# Altium project Team_Scheire_Maarten_00.PrjPcb
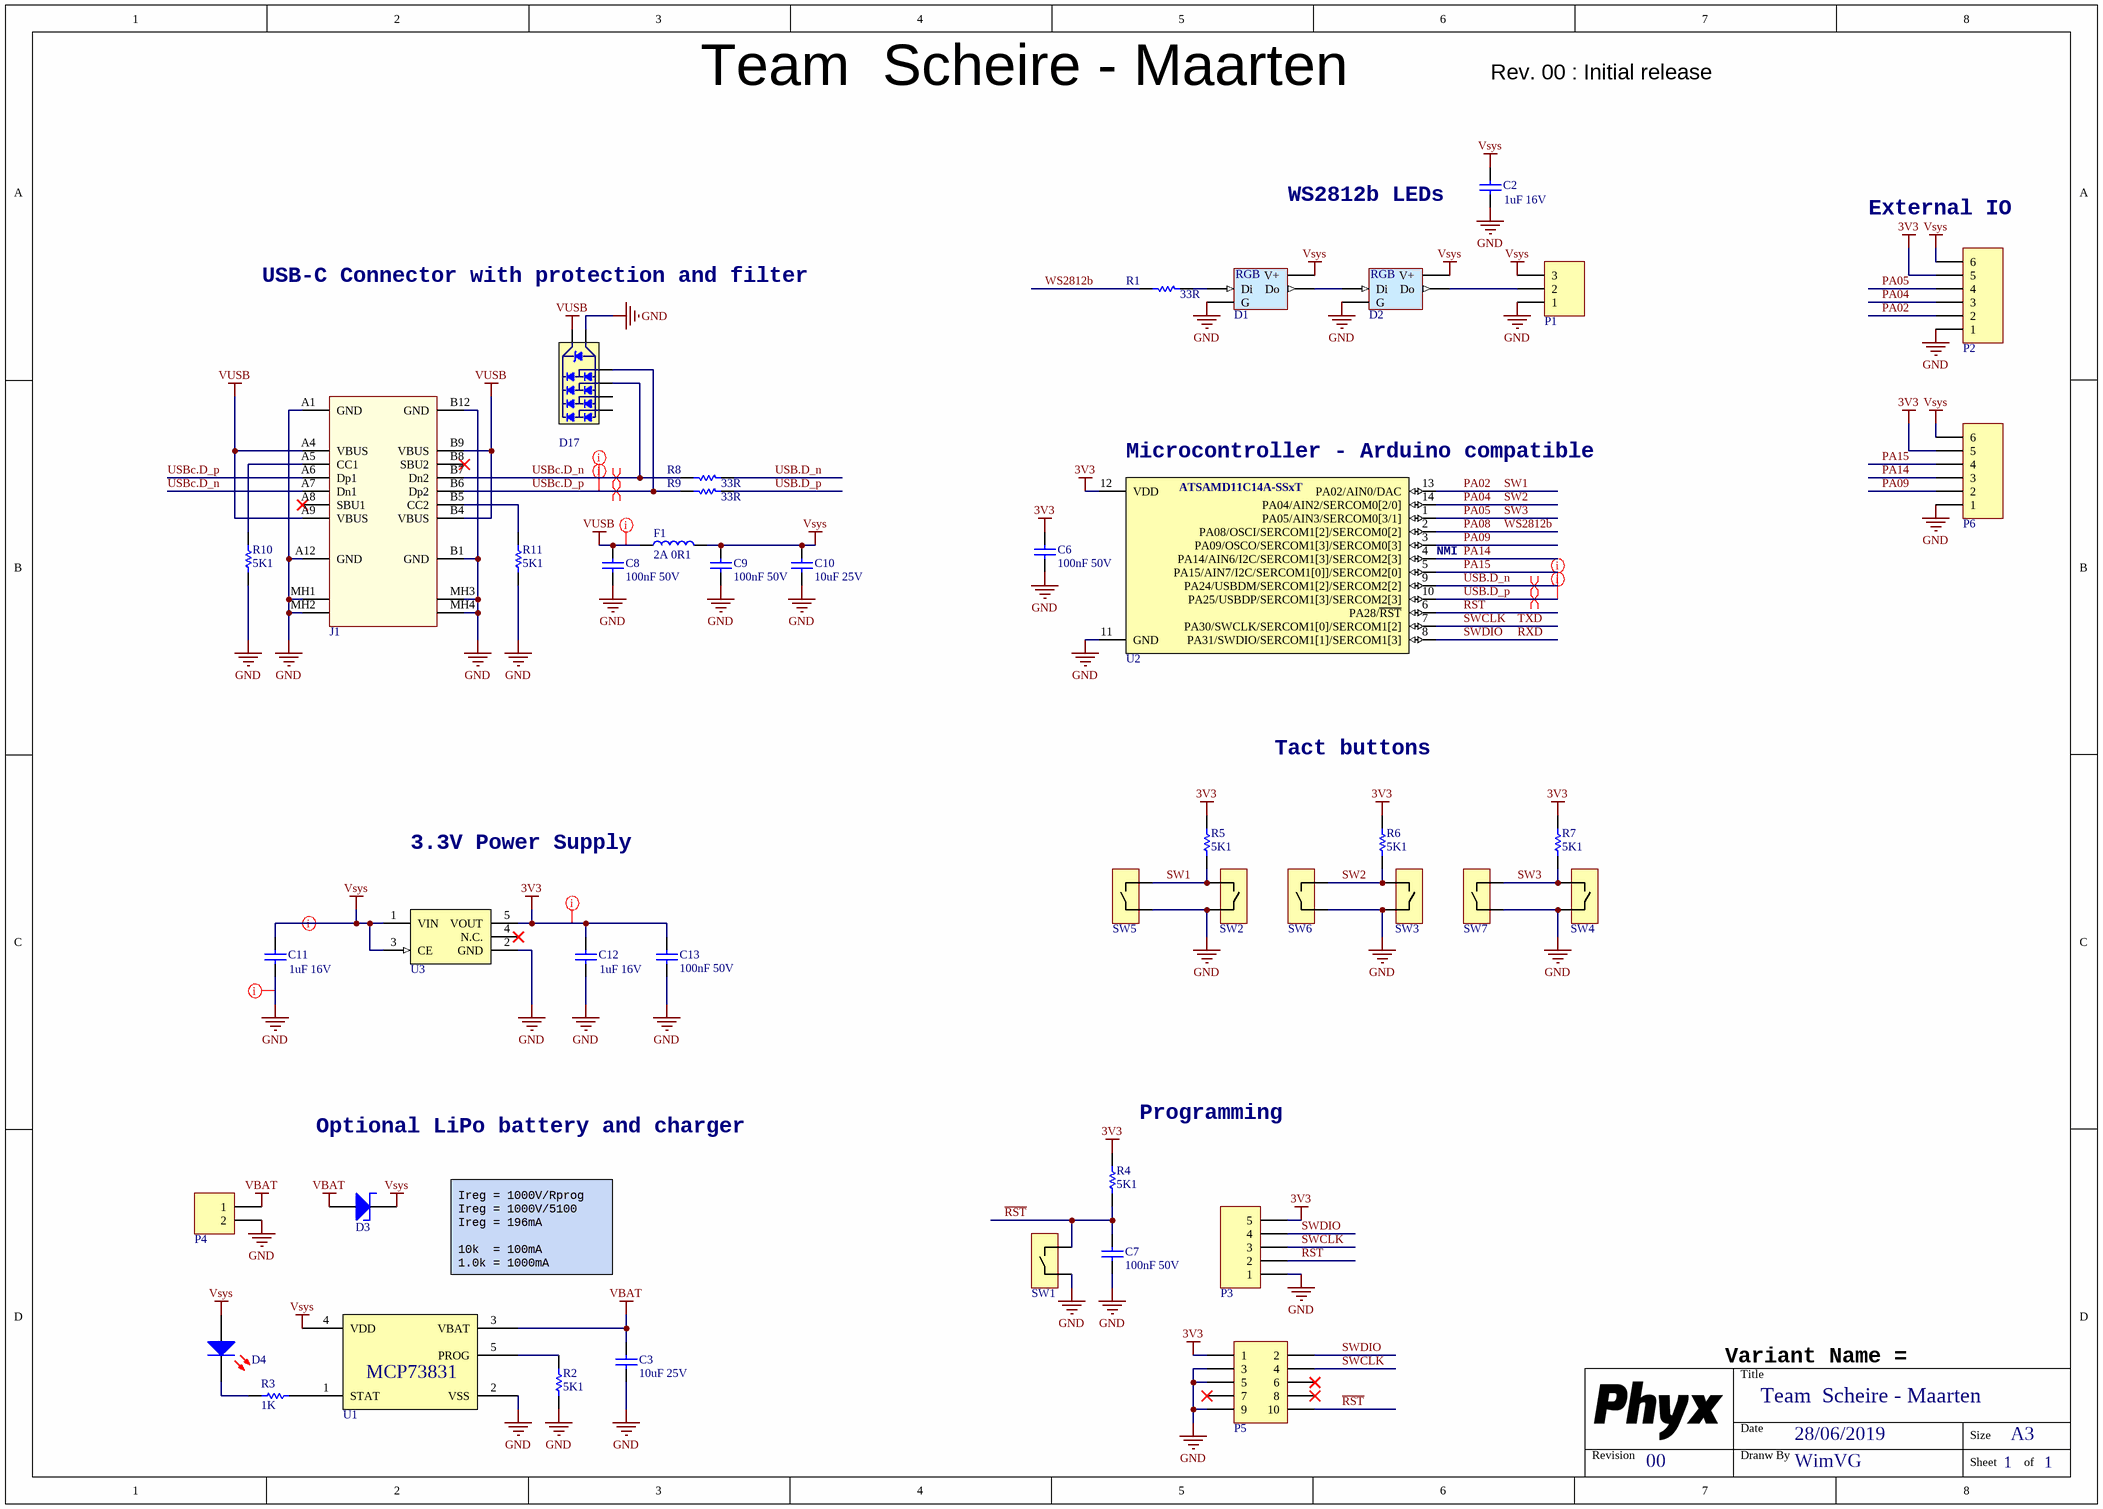
[diagram p0: Team_Scheire_Maarten_00.SchDoc]
PCB_ENGINEER: WimVG; PCB_REV: 00; PCB_TITLE: Team_Scheire_Maarten
1 sheet, 44 parts. Net scope: global (net labels, ports and power ports of the same name join across sheets).
Board file: Team_Scheire_Maarten_00.PcbDoc

## Sheet Team_Scheire_Maarten_00.SchDoc: Team  Scheire - Maarten
size A3; Date: 28/06/2019; DrawnBy: WimVG; Engineer: WimVG; Revision: 00; SheetNumber: 1; SheetTotal: 1

### Parts
C2  value 1uF 16V  [C0603_N]  (hidden comment: CAP_CERAMIC)
C3  value 10uF 25V  [C1206_N]  (hidden comment: CAP_CERAMIC)
C6  value 100nF 50V  [C0603_N]  (hidden comment: CAP_CERAMIC)
C7  value 100nF 50V  [C0603_N]  (hidden comment: CAP_CERAMIC)
C8  value 100nF 50V  [C0603_N]  (hidden comment: CAP_CERAMIC)
C9  value 100nF 50V  [C0603_N]  (hidden comment: CAP_CERAMIC)
C10  value 10uF 25V  [C1206_N]  (hidden comment: CAP_CERAMIC)
C11  value 1uF 16V  [C0603_N]  (hidden comment: CAP_CERAMIC)
C12  value 1uF 16V  [C0603_N]  (hidden comment: CAP_CERAMIC)
C13  value 100nF 50V  [C0603_N]  (hidden comment: CAP_CERAMIC)
D1  WS2812 based digital RGB LED 5050 Black package  [LED_5050_WS2812B_BLACK]  (value not drawn)
D2  WS2812 based digital RGB LED 5050 Black package  [LED_5050_WS2812B_BLACK]  (value not drawn)
D3  MBR0540T3G Schottky ULTRAFAST, 500MA, 40V  [ON_SOD-123FL]  (value not drawn)
D4  Default 0805 Red LED  [LED_0805_RD]  (value not drawn)
D17  TVS Diode Dual USB  [NXP_SOT457]  (value not drawn)
F1  value 2A 0R1  [L0805]  (hidden comment: FERRITE)
J1  USB 2.0 C Reversible Receptacle Horizontal  [HRO_TYPE-C-31-M-12]  (value not drawn)
P1  Header 2.0mm Shrouded 3  [WE_620103131822]  (value not drawn)
P2  Header 6  [HDR1X6]  (value not drawn)
P3  Header 1.0mm Shrouded 5  [WE_665305124022]  (value not drawn)
P4  Header 2.0mm Shrouded 2  [WE_620102131822]  (value not drawn)
P5  Header 5x2  [HDR2X5_1.27_SMD]  (value not drawn)
P6  Header 6  [HDR1X6]  (value not drawn)
R1  value 33R  [R0603_N]  (hidden comment: RESISTOR)
R2  value 5K1  [R0603_N]  (hidden comment: RESISTOR)
R3  value 1K  [R0603_N]  (hidden comment: RESISTOR)
R4  value 5K1  [R0603_N]  (hidden comment: RESISTOR)
R5  value 5K1  [R0603_N]  (hidden comment: RESISTOR)
R6  value 5K1  [R0603_N]  (hidden comment: RESISTOR)
R7  value 5K1  [R0603_N]  (hidden comment: RESISTOR)
R8  value 33R  [R0603_N]  (hidden comment: RESISTOR)
R9  value 33R  [R0603_N]  (hidden comment: RESISTOR)
R10  value 5K1  [R0603_N]  (hidden comment: RESISTOR)
R11  value 5K1  [R0603_N]  (hidden comment: RESISTOR)
SW1  LP SMD tact sw  [CK_KMR4]  (value not drawn)
SW2  Tact switch, 12mm, 160g, 7,3mm rect  [ESW_TL3300A]  (value not drawn)
SW3  Tact switch, 12mm, 160g, 7,3mm rect  [ESW_TL3300A]  (value not drawn)
SW4  Tact switch, 12mm, 160g, 7,3mm rect  [ESW_TL3300A]  (value not drawn)
SW5  4.5x4.5mm tact SMD H3,8mm  [WE_430181038816]  (value not drawn)
SW6  4.5x4.5mm tact SMD H3,8mm  [WE_430181038816]  (value not drawn)
SW7  4.5x4.5mm tact SMD H3,8mm  [WE_430181038816]  (value not drawn)
U1  Single Cell LiPo LiIon charger  [SOT23-5]  (value not drawn)
U2  Microchip Atmel SAMD11C14 SOIC14 Cortex-M0 32-bit MCU, 16 KB Flash, 4KB RAM  [SOIC_N_14]  (value not drawn)
U3  3V3 LDO 700mA 50mV  [SOT23-5]  (value not drawn)

### Nets
3V3: C6.1 C12.1 C13.1 P2.5 P3.5 P5.1 P6.5 R4.1 R5.1 R6.1 R7.1 U2.12(VDD) U3.5(VOUT)
GND: C2.2 C3.2 C6.2 C7.2 C8.2 C9.2 C10.2 C11.2 C12.2 C13.2 D1.3(G) D2.3(G) D17.2(GND) J1.A1(GND) J1.A12(GND) J1.B1(GND) J1.B12(GND) J1.MH1(Tab) J1.MH2(Tab) J1.MH3(Tab) J1.MH4(Tab) P1.1 P2.1 P3.1 P4.2 P5.3 P5.5 P5.9 P6.1 R2.2 R10.2 R11.2 SW1.2 SW2.2 SW3.2 SW4.2 SW5.2 SW6.2 SW7.2 U1.2(VSS) U2.11(GND) U3.2(GND)
VBAT: C3.1 D3.2(A) P4.1 U1.3(VBAT)
Vsys: C2.1 C9.1 C10.1 C11.1 D1.1(V+) D2.1(V+) D3.1(C) D4.1(A) F1.2 P1.3 P2.6 P6.6 U1.4(VDD) U3.1(VIN) U3.3(CE)
VUSB: C8.1 D17.5(VBus) F1.1 J1.A4(VBUS) J1.A9(VBUS) J1.B4(VBUS) J1.B9(VBUS)
PA02: P2.2 R5.2 SW2.1 SW5.1 U2.13(PA02/AIN0/DAC)  [also labelled SW1]
PA04: P2.3 R6.2 SW3.1 SW6.1 U2.14(PA04/AIN2/SERCOM0[2/0])  [also labelled SW2]
PA05: P2.4 R7.2 SW4.1 SW7.1 U2.1(PA05/AIN3/SERCOM0[3/1])  [also labelled SW3]
PA08: R1.1 U2.2(PA08/OSCI/SERCOM1[2]/SERCOM0[2])  [also labelled WS2812b]
PA09: P6.2 U2.3(PA09/OSCO/SERCOM1[3]/SERCOM0[3])
PA14: P6.3 U2.4(PA14/AIN6/I2C/SERCOM1[3]/SERCOM2[3])
PA15: P6.4 U2.5(PA15/AIN7/I2C/SERCOM1[0]]/SERCOM2[0])
~{RST}: C7.1 P3.2 P5.10 R4.2 SW1.1 U2.6(PA28/~{RST})
RXD: P3.4 P5.2 U2.8(PA31/SWDIO/SERCOM1[1]/SERCOM1[3])  [also labelled SWDIO]
SWCLK: P3.3 P5.4 U2.7(PA30/SWCLK/SERCOM1[0]/SERCOM1[2])  [also labelled TXD]
USB.D_n: R8.2 U2.9(PA24/USBDM/SERCOM1[2]/SERCOM2[2])
USB.D_p: R9.2 U2.10(PA25/USBDP/SERCOM1[3]/SERCOM2[3])
USBc.D_n: D17.1 J1.A7(Dn1) J1.B7(Dn2) R8.1
USBc.D_p: D17.3 J1.A6(Dp1) J1.B6(Dp2) R9.1
NetD1_2: D1.2(Do) D2.4(Di)
NetD1_4: D1.4(Di) R1.2
NetD2_2: D2.2(Do) P1.2
NetD4_2: D4.2(K) R3.2
NetJ1_A5: J1.A5(CC1) R10.1
NetJ1_B5: J1.B5(CC2) R11.1
NetR2_1: R2.1 U1.5(PROG)
NetR3_1: R3.1 U1.1(STAT)

Not connected (* = marked no-connect by the designer): D17 4 6; J1 A8(SBU1)* B8(SBU2)*; P5 6* 7* 8*; U3 4(N.C.)*

### Layout directives
differential pair: USB.D_n, USB.D_p, USBc.D_n, USBc.D_p
net class 90R: USB.D_n, USB.D_p, USBc.D_n, USBc.D_p
net class Power: 3V3, GND, Vsys, VUSB

### Notes on the sheet
- Rev. 00 : Initial release
- WS2812b LEDs
- (near P2) External IO
- USB-C Connector with protection and filter
- (near U2) Microcontroller - Arduino compatible
- (near U2) NMI
- Tact buttons
- 3.3V Power Supply
- (near R4) Programming
- Optional LiPo battery and charger
- Ireg = 1000V/Rprog
  Ireg = 1000V/5100
  Ireg = 196mA
  10k  = 100mA
  1.0k = 1000mA
- Variant Name =
- Title
- Revision
- Date
- Dranw By
- Size
- A3
- Sheet
- of
- (in symbol LED # RGB WS2812B-5050 BL) RGB

### Library data of the parts
C2 C11 C12 = CAP # 1uF 16V 0603: Capacitor Ceramic; Supplier 1: Farnell; Supplier Part Number 1: 2320814
C3 C10 = CAP # 10uF 25V 1206: Supplier 1: Farnell; Supplier Part Number 1: 2320887
C6-C9 C13 = CAP # 100nF 50V 0603: Supplier 1: Farnell; Supplier Part Number 1: 1759122
D1 D2 = LED # RGB WS2812B-5050 BL: =Description; Value: WS218B 5050 BL; Supplier 1: Aliexpress; Supplier Part Number 1: WS2812B Black 5050
D3 = Schottky # MBR0540T3G: =Description; Value: MBR0540T3G; Supplier 1: Farnell; Supplier Part Number 1: 2101839
D4 = LED # Red 0805: =Description; Supplier 1: Farnell; Supplier Part Number 1: 2099236
D17 = TVS # IP4220CZ6 Dual USB: Value: IP4220CZ6; Supplier 1: Farnell; Supplier Part Number 1: 2143248
F1 = FER # 600R 2A 0805: Supplier 1: Farnell; Supplier Part Number 1: 1838838
J1 = USB # C 2.0 RCPT TYPE-C-31-M-12: Value: TYPE-C-31-M-12; Supplier 1: China; Supplier Part Number 1: HRO TYPE-C-31-M-12; Supplier 2: LCSC; Supplier Part Number 2: C165948; Supplier 3: LCSC ALT; Supplier Part Number 3: C167321 / C319148
P1 = HDR # SHR 2.0mm 3way - 620103131822: Value: 620103131822; Supplier 1: Wurth; Supplier Part Number 1: 620103131822; Supplier 2: Mouser; Supplier Part Number 2: 710-620103131822
P2 P6 = Pin Header 2.54mm 6way
P3 = HDR # SHR 1.0mm 5way - 665305124022: Value: 665305124022; Supplier 1: Wurth; Supplier 2: Mouser; Supplier Part Number 1: 665305124022; Supplier Part Number 2: 710-665305124022
P4 = HDR # SHR 2.0mm 2way - 620102131822: Value: 620102131822; Supplier 1: Wurth; Supplier Part Number 1: 620102131822; Supplier 2: Mouser; Supplier Part Number 2: 710-620102131822
P5 = Pin Header # 1.27mm dual row 10way: Supplier 1: Farnell; Supplier Part Number 1: 1022310; Supplier 2: Wurth; Supplier Part Number 2: 621 010 210 21
R1 R8 R9 = RES # 33R 0603: Supplier 1: Farnell; Supplier Part Number 1: 2446661
R2 R4-R7 R10 R11 = RES # 5K1 0603: Supplier 1: Farnell; Supplier Part Number 1: 2845922
R3 = RES # 1K 0603: Supplier 1: Farnell; Supplier Part Number 1: 2689409
SW1 = SW # KMR4: Value: KMR442GULCLFS; Supplier 1: Farnell; Supplier Part Number 1: 1908256
SW2-SW4 = SW # TACT 12mm 7,3mm 160g TL3300AF160Q: Value: TL3300AF160Q; Supplier 1: Digi-key; Supplier Part Number 1: EG4902CT-ND
SW5-SW7 = SW # TACT small 4.5x4.5mm SMD WS-TASV: Value: 430181038816; Supplier 1: Wurth; Supplier Part Number 1: 430181038816; Supplier 2: Mouser; Supplier Part Number 2: 710-430181038816
U1 = MicroChip # MCP73831 LiPo CHG: =Description; Value: MCP73831; Supplier 1: Farnell; Supplier Part Number 1: 1834890
U2 = M0 # ATSAMD11C14A-SSUT: Value: ATSAMD11C14; Supplier 1: Farnell; Supplier Part Number 1: 2484375; Supplier 2: Digi-key; Supplier Part Number 2: ATSAMD11C14A-SSUTCT-ND
U3 = LDO # 3V3 XC6210B33: =Designator; Value: XC6210B332MR; Supplier 1: Farnell; Supplier Part Number 1: 1057803

## Assembly variants
Default: not fitted C2 C3 D3 D4 P1 P2 P3 P4 P6 R2 R3 R5 R6 R7 SW1 SW2 SW3 SW4 SW5 SW6 SW7 SW8 U1
Full_option: not fitted P2 P6 R5 R6 R7 SW5 SW6 SW7